# EAGLE design tmc-260-shield (EAGLE 6.3)
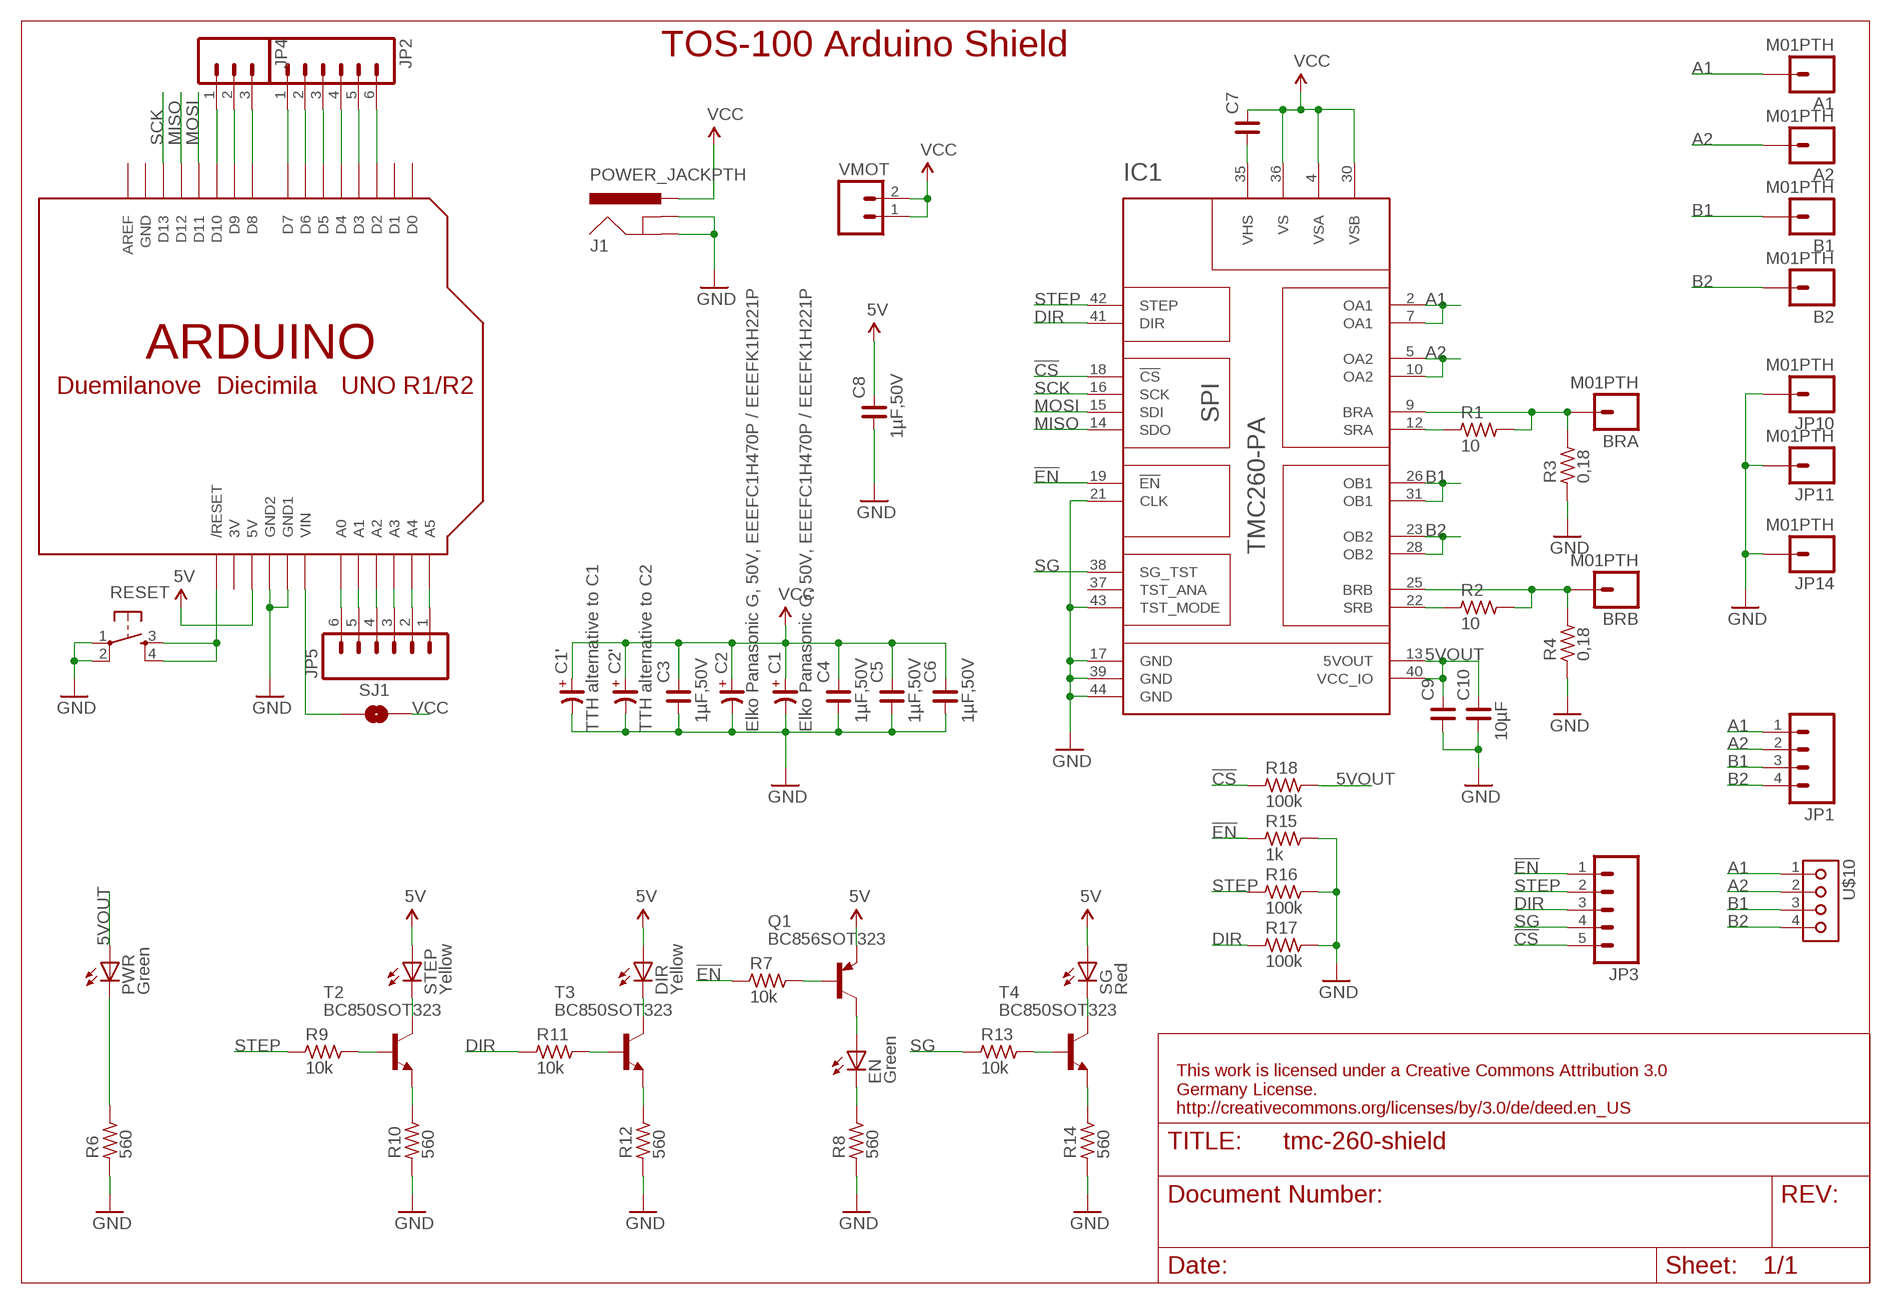
[diagram p0: schematic, sheet 1]

## Parts
A1  M01PTH  [1X01]
A2  M01PTH  [1X01]
B1  M01PTH  [1X01]
B2  M01PTH  [1X01]
BRA  M01PTH  [1X01]
BRB  M01PTH  [1X01]
C1  Elko Panasonic G, 50V, EEEFC1H470P / EEEFK1H221P  CP_SV-G  [CSV-G]
C1'  TTH alternative to C1  CP_E-035X100  [CE-035X100]
C2  Elko Panasonic G, 50V, EEEFC1H470P / EEEFK1H221P  CP_SV-G  [CSV-G]
C2'  TTH alternative to C2  CP_E-035X100  [CE-035X100]
C3  1µF,50V  C_0603  [C0603]
C4  1µF,50V  C_0603  [C0603]
C5  1µF,50V  C_0603  [C0603]
C6  1µF,50V  C_1206  [C1206]
C7  C_0603  [C0603]
C8  1µF,50V  C_0603  [C0603]
C9  C_0603  [C0603]
C10  10µF  C_0603  [C0603]
DIR  Yellow  LEDMICRO-SIDELED  [MICRO-SIDELED]
EN  Green  LEDMICRO-SIDELED  [MICRO-SIDELED]
IC1  TMC260-PA  [PQFP44_WITH_PADS]
J1  POWER_JACKPTH  [POWER_JACK_PTH]
JP1  M04SCREW  [SCREWTERMINAL-3.5MM-4]
JP2  M06SIP  [1X06]
JP3  M05PTH  [1X05]
JP4  M03PTH  [1X03]
JP5  M06SIP  [1X06]
JP10  M01PTH  [1X01]
JP11  M01PTH  [1X01]
JP14  M01PTH  [1X01]
PWR  Green  LEDMICRO-SIDELED  [MICRO-SIDELED]
Q1  BC856SOT323  BC858SOT323  [SOT323-BEC]
R1  10  R_0603  [R0603]
R2  10  R_0603  [R0603]
R3  0,18  R_2512  [R2512]
R4  0,18  R_2512  [R2512]
R6  560  R_0603  [R0603]
R7  10k  R_0603  [R0603]
R8  560  R_0603  [R0603]
R9  10k  R_0603  [R0603]
R10  560  R_0603  [R0603]
R11  10k  R_0603  [R0603]
R12  560  R_0603  [R0603]
R13  10k  R_0603  [R0603]
R14  560  R_0603  [R0603]
R15  1k  R_0603  [R0603]
R16  100k  R_0603  [R0603]
R17  100k  R_0603  [R0603]
R18  100k  R_0603  [R0603]
RESET  TAC_SWITCHSMD  [TACTILE_SWITCH_SMD]
SG  Red  LEDMICRO-SIDELED  [MICRO-SIDELED]
SJ1  SOLDERJUMPERNO  [SJ_2S-NO]
STEP  Yellow  LEDMICRO-SIDELED  [MICRO-SIDELED]
T2  BC850SOT323  [SOT323-BEC]
T3  BC850SOT323  [SOT323-BEC]
T4  BC850SOT323  [SOT323-BEC]
U$1  ARDUINOUNO  [ARDUINO]
U$10  KK4H  [KK-H-4]
VMOT  M021X02_NO_SILK  [1X02_NO_SILK]

## Nets
5V: C8.2 DIR.A Q1.E SG.A STEP.A U$1.5V
5VOUT: C9.2 C10.2 IC1.13(5VOUT) IC1.40(VCC_IO) PWR.A R18.2
!CS: IC1.18(!CS) JP3.5 R18.1
!EN: IC1.19(!EN) JP3.1 R7.1 R15.1
A1: A1.1 IC1.2(OA1) IC1.7(OA1) JP1.1 U$10.1
A2: A2.1 IC1.5(OA2) IC1.10(OA2) JP1.2 U$10.2
B1: B1.1 IC1.26(OB1) IC1.31(OB1) JP1.3 U$10.3
B2: B2.1 IC1.23(OB2) IC1.28(OB2) JP1.4 U$10.4
DIR: IC1.41(DIR) JP3.3 R11.1 R17.1
GND: C1'.- C1.- C2'.- C2.- C3.1 C4.1 C5.1 C6.1 C8.1 C9.1 C10.1 IC1.17(GND) IC1.21(CLK) IC1.39(GND) IC1.43(TST_MODE) IC1.44(GND) J1.GND J1.GNDBREAK JP10.1 JP11.1 JP14.1 R3.1 R4.1 R6.1 R8.1 R10.1 R12.1 R14.1 R15.2 R16.2 R17.2 RESET.1 RESET.2 U$1.GND1 U$1.GND2
MISO: IC1.14(SDO) U$1.D12
MOSI: IC1.15(SDI) U$1.D11
N$1: JP4.1 U$1.D10
N$2: JP4.2 U$1.D9
N$3: JP4.3 U$1.D8
N$4: JP2.1 U$1.D7
N$5: JP2.2 U$1.D6
N$6: JP2.3 U$1.D5
N$7: JP2.4 U$1.D4
N$8: JP2.5 U$1.D3
N$9: JP2.6 U$1.D2
N$10: JP5.1 U$1.A5
N$11: JP5.2 U$1.A4
N$12: JP5.3 U$1.A3
N$13: JP5.4 U$1.A2
N$14: JP5.5 U$1.A1
N$15: JP5.6 U$1.A0
N$16: R9.2 T2.B
N$17: RESET.3 RESET.4 U$1.RESET(/RESET)
N$18: SJ1.1 U$1.VIN
N$19: STEP.C T2.C
N$20: R10.2 T2.E
N$21: PWR.C R6.2
N$24: R11.2 T3.B
N$25: DIR.C T3.C
N$26: R12.2 T3.E
N$27: EN.A Q1.C
N$28: BRA.1 IC1.9(BRA) R1.2 R3.2
N$29: IC1.12(SRA) R1.1
N$30: BRB.1 IC1.25(BRB) R2.2 R4.2
N$31: IC1.22(SRB) R2.1
N$35: EN.C R8.2
N$36: Q1.B R7.2
N$38: R13.2 T4.B
N$39: SG.C T4.C
N$40: R14.2 T4.E
SCK: IC1.16(SCK) U$1.D13
SG: IC1.38(SG_TST) JP3.4 R13.1
STEP: IC1.42(STEP) JP3.2 R9.1 R16.1
VCC: C1'.+ C1.+ C2'.+ C2.+ C3.2 C4.2 C5.2 C6.2 C7.2 IC1.4(VSA) IC1.30(VSB) IC1.36(VS) J1.PWR SJ1.2 VMOT.1 VMOT.2
VHS: C7.1 IC1.35(VHS)
Unconnected: IC1.37(TST_ANA) U$1.AREF U$1.D0 U$1.D1

## Notes on the sheet
- TOS-100 Arduino Shield
- This work is licensed under a Creative Commons Attribution 3.0 
  Germany License.
  http://creativecommons.org/licenses/by/3.0/de/deed.en_US

## Power pins joined to a net without a drawn wire
3V: U$1.3V
GND: U$1.GND

## Library data of the parts
A1 A2 B1 B2 BRA BRB JP10 JP11 JP14 = SparkFun:M01: Header 1 Standard 1-pin 0.1" header. Use with straight break away headers (SKU : PRT-00116), right angle break away headers (PRT-00553), swiss pins (PRT-00743), machine pins (PRT-00117), and female headers (PRT-00115).
C1 C1' C2 C2' = rc-master:CP_: POLARIZED CAP
C3-C10 = rc-master-smd:C_: NON-POLARIZED CAP
DIR EN PWR SG STEP = LED:LED: LED OSRAM: - CHIPLED LG R971, LG N971, LY N971, LG Q971, LY Q971, LO R971, LY R971 LH N974, LH R974 LS Q976, LO Q976, LY Q976 LO Q996 - Hyper CHIPLED LW Q18S LB Q993, LB Q99A, LB R99A - SideLED LS A670, LO A670, LY A670, LG A670, LP A670 LB A673, LV A673, LT A673, LW A673 LH A674 LY A675 LS A676, LA A676, LO A676, LY A676, LW A676 LS A679, LY A679, LG A679 - Hyper Micro SIDELED® LS Y876, LA Y876, LO Y876, LY Y876 LT Y87S - SmartLED LW L88C, LW L88S LB L89C, LB L89S, LG L890 LS L89K, LO L89K, LY L89K LS L896, LA L896, LO L896, LY L896 - TOPLED LS T670, LO T670, LY T670, LG T670, LP T670 LSG T670, LSP T670, LSY T670, LOP T670, LYG T670 LG T671, LOG T671, LSG T671 LB T673, LV T673, LT T673, LW T673 LH T674 LS T676, LA T676, LO T676, LY T676, LB T676, LH T676, LSB T676, LW T676 LB T67C, LV T67C, LT T67C, LS T67K, LO T67K, LY T67K, LW E67C LS E67B, LA E67B, LO E67B, LY E67B, LB E67C, LV E67C, LT E67C LW T67C LS T679, LY T679, LG T679 LS T770, LO T770, LY T770, LG T770, LP T770 LB T773, LV T773, LT T773, LW T773 LH T774 LS E675, LA E675, LY E675, LS T675 LS T776, LA T776, LO T776, LY T776, LB T776 LHGB T686 LT T68C, LB T68C - Hyper Mini TOPLED® LB M676 - Mini TOPLED Santana® LG M470 LS M47K, LO M47K, LY M47K Source: http://www.osram.convergy.de LUXEON: - LUMILED® LXK2-PW12-R00, LXK2-PW12-S00, LXK2-PW14-U00, LXK2-PW14-V00 LXK2-PM12-R00, LXK2-PM12-S00, LXK2-PM14-U00 LXK2-PE12-Q00, LXK2-PE12-R00, LXK2-PE12-S00, LXK2-PE14-T00, LXK2-PE14-U00 LXK2-PB12-K00, LXK2-PB12-L00, LXK2-PB12-M00, LXK2-PB14-N00, LXK2-PB14-P00, LXK2-PB14-Q00 LXK2-PR12-L00, LXK2-PR12-M00, LXK2-PR14-Q00, LXK2-PR14-R00 LXK2-PD12-Q00, LXK2-PD12-R00, LXK2-PD12-S00 LXK2-PH12-R00, LXK2-PH12-S00 LXK2-PL12-P00, LXK2-PL12-Q00, LXK2-PL12-R00 Source: www.luxeon.com KINGBRIGHT: KA-3528ASYC Source: www.kingbright.com
IC1 = trinamic-2:TMC260-PA: TRINAMIC Energy Efficient Microstep Driver for up to 1.7A with coolStep™ Information given in this library is believed to be accurate and reliable. However no warranty is given for its correctness. Datasheet for TMC260/261/262 <http://www.trinamic.com/tmc/media/Downloads/integrated_circuits/TMC262/TMC260_TMC261_TMC262_datasheet.pdf> Description Energy Efficient Microstep Driver for up to 1.7A with coolStep™ The TMC260 is the first energy efficient high precision microstepping driver IC for bipolar stepper motors with integrated power MOSFETs. The unique high resolution sensorless load detection stallGuard2™ is used to for the world™s first integrated load dependent current control feature called coolStep™. The ability to read out the load and detect an overload makes the TMC260 an optimum choice for drives where a high reliability is desired at a low cost. The new patented spreadCycle PWM mixed decay chopper scheme ensures best zero crossing performance as well as high speed operation. The TMC260 can be driven with Step & Direction signals as well as by serial SPI™ interface. Using the microPlyer allows to operate the motor with highest 256 ™Step smoothness reducing the input frequency to 16 ™Steps. A full set of protection and diagnostic features makes this device very rugged. It directly drives stepper motors with up to 1.7A. This way it reaches highest energy efficiency and allows driving of a high motor current without cooling measures even at high environment temperatures. Specifications Main characteristics 2-phase bipolar stepper motor driver stallGuard2™ sensorless load detection coolStep™ load dependent current control save up to 80% energy spreadCycle hysteresis PWM chopper best current zero crossing performance best sine wave form 256 ™Steps/fullstep (51200 pos/rev.) with a standard 200 step motor microPlyer 16-to-256 ™Step multiplyer full protection and diagnostics lowest power dissipation programmable slope control for low EME standby and shutdown mode stall / load detection output Low power consumption via low RDS-ON power stage Interface Step & Direction easy-to-use SPI™ (20bit) Electrical Data up to 1.7A coil current (peak) 9V to 40V motor supply 3.3V or 5V operation for digital part Package TQFP44 10x10 mm² package RoHS compliant
J1 = SparkFun:POWER_JACK: Power Jack This is the standard 5.5mm barrel jack for power. The PTH is the most common, proven, reliable, footprint. All others are experimental. The Slot footprint only works if the mill layer is transmitted to the PCB fab house so be warned. Spark Fun Electronics SKU : PRT-00119. Mating wall wart : TOL-00298 (and others)
JP1 = SparkFun:M04: Header 4 Standard 4-pin 0.1" header. Use with straight break away headers (SKU : PRT-00116), right angle break away headers (PRT-00553), swiss pins (PRT-00743), machine pins (PRT-00117), and female headers (PRT-00115). Molex polarized connector foot print use with SKU : PRT-08231 with associated crimp pins and housings.
JP2 JP5 = SparkFun:M06: Header 6 Standard 6-pin 0.1" header. Use with straight break away headers (SKU : PRT-00116), right angle break away headers (PRT-00553), swiss pins (PRT-00743), machine pins (PRT-00117), and female headers (PRT-00115). Molex polarized connector foot print use with SKU : PRT-08094 with associated crimp pins and housings. NOTES ON THE VARIANTS LOCK and LOCK_LONGPADS... This footprint was designed to help hold the alignment of a through-hole component (i.e. 6-pin header) while soldering it into place. You may notice that each hole has been shifted either up or down by 0.005 of an inch from it's more standard position (which is a perfectly straight line). This slight alteration caused the pins (the squares in the middle) to touch the edges of the holes. Because they are alternating, it causes a "brace" to hold the component in place. 0.005 has proven to be the perfect amount of "off-center" position when using our standard breakaway headers. Although looks a little odd when you look at the bare footprint, once you have a header in there, the alteration is very hard to notice. Also, if you push a header all the way into place, it is covered up entirely on the bottom side. This idea of altering the position of holes to aid alignment will be further integrated into the Sparkfun Library for other footprints. It can help hold any component with 3 or more connection pins.
JP3 = SparkFun:M05: Header 5 Standard 5-pin 0.1" header. Use with straight break away headers (SKU : PRT-00116), right angle break away headers (PRT-00553), swiss pins (PRT-00743), machine pins (PRT-00117), and female headers (PRT-00115). Molex polarized connector foot print use with SKU : PRT-08230 with associated crimp pins and housings.
JP4 = SparkFun:M03: Header 3 Standard 3-pin 0.1" header. Use with straight break away headers (SKU : PRT-00116), right angle break away headers (PRT-00553), swiss pins (PRT-00743), machine pins (PRT-00117), and female headers (PRT-00115). Molex polarized connector foot print use with SKU : PRT-08232 with associated crimp pins and housings.
Q1 = additional:BC858*: PNP Transistror
R1-R4 R6-R18 = rc-master-smd:R_: RESISTOR
RESET = SparkFun:TAC_SWITCH: Momentary Switch Button commonly used for reset or general input. Spark Fun Electronics SKU : COM-00097
SJ1 = SparkFun:SOLDERJUMPER: Solder Jumper Standard SMD solder jumper. Used to automate production. Two varients : Normally Open and Normally Closed are the same, but have different paste layers. NC will have a large amount of paste and should jumper during reflow.
T2-T4 = additional:BC850: NPN TRANSISTOR
U$1 = adafruit:ARDUINO: Arduino Diecimila/Duemilanove Make a shield with ease, this package has all the named pins as well as the two mounting drill holes and an outline of the USB and DC power connector. The outline is on the DIMENSION layer, so if your board house uses it they will cut the outline to match. http://www.ladyada.net/library/pcb/eaglelibrary.html
U$10 = molex-kk:KK4*
VMOT = SparkFun:M02: Header 2 Standard 2-pin 0.1" header. Use with straight break away headers (SKU : PRT-00116), right angle break away headers (PRT-00553), swiss pins (PRT-00743), machine pins (PRT-00117), and female headers (PRT-00115). Molex polarized connector foot print use with SKU : PRT-08233 with associated crimp pins and housings.

## Board
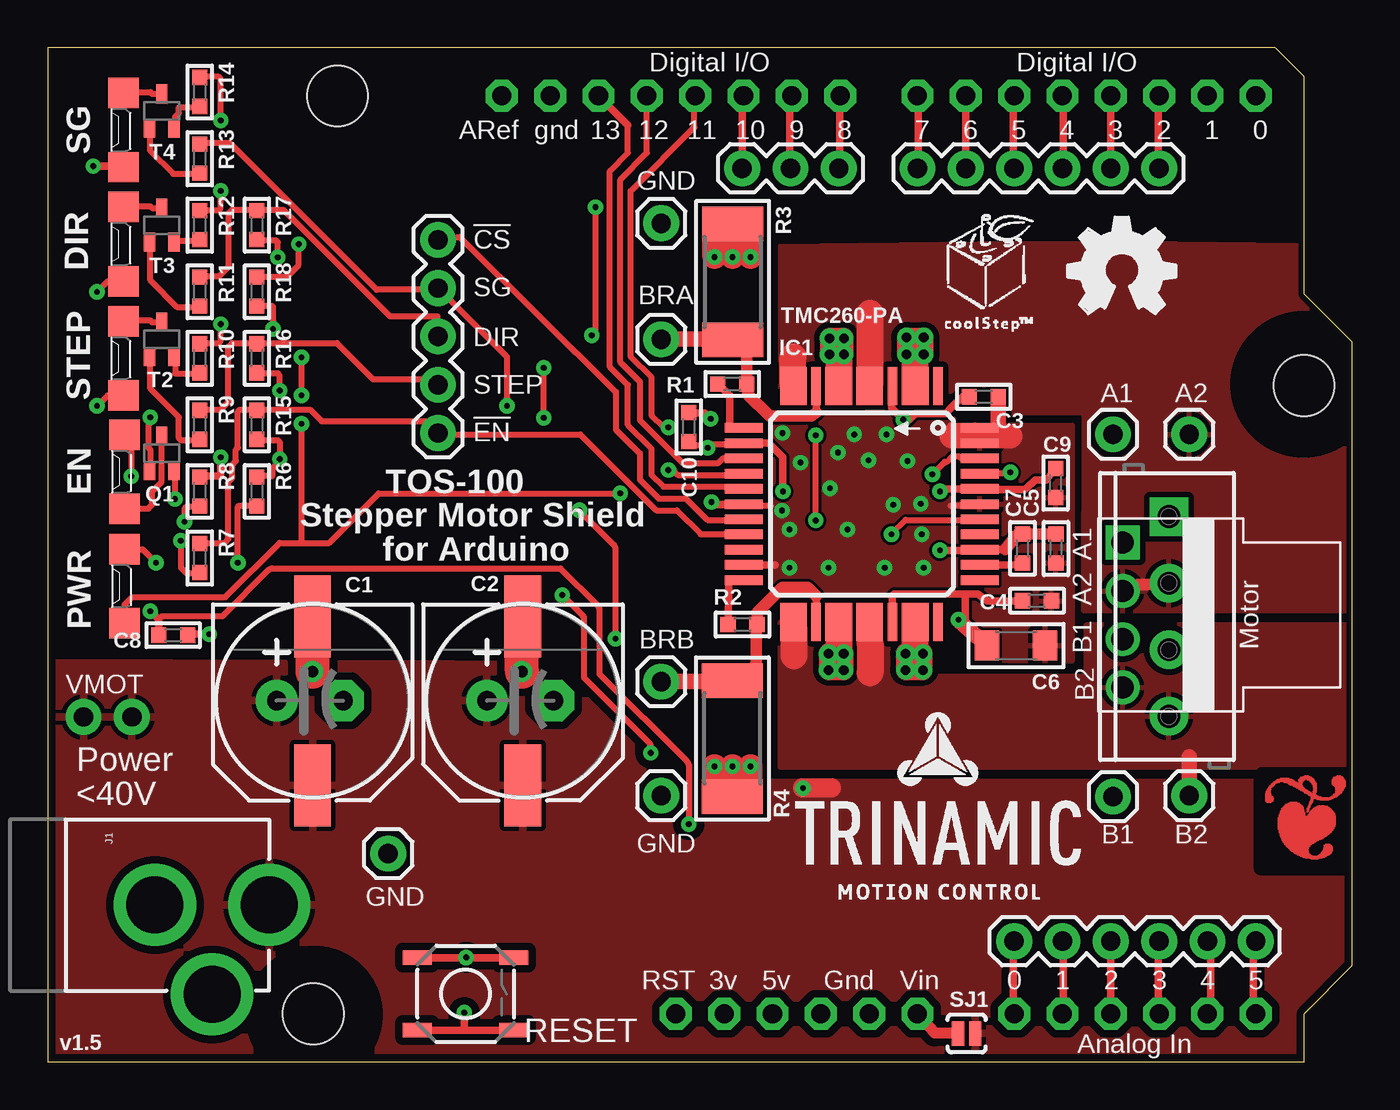
[diagram p1: board, top side]
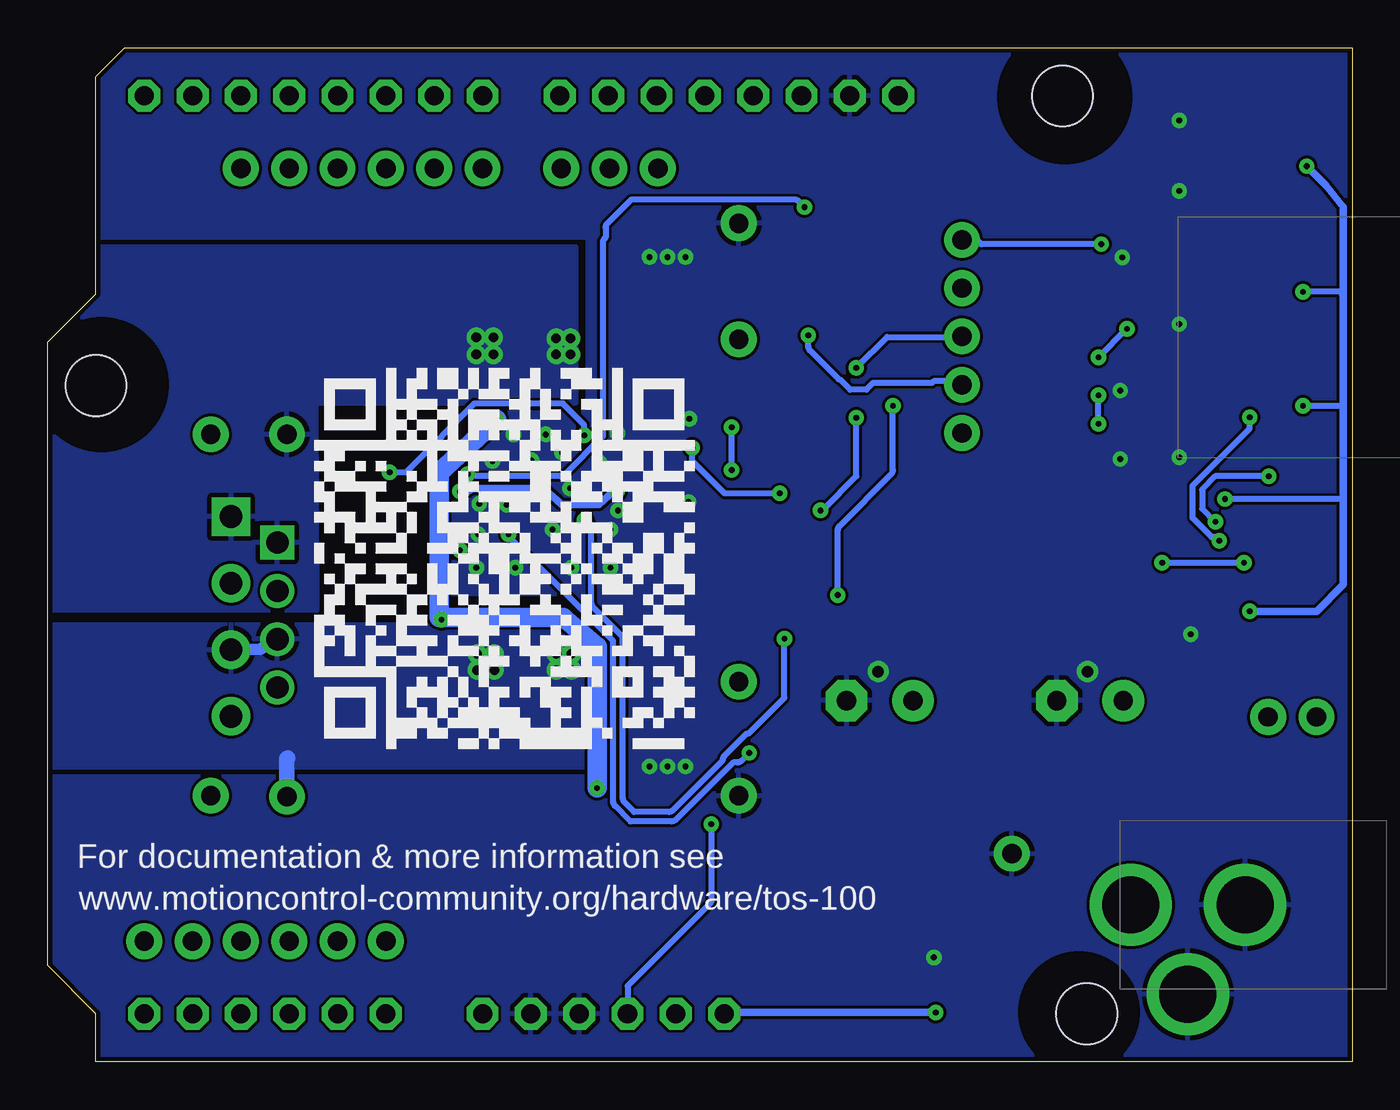
[diagram p2: board, bottom side, seen from below]

Size 68.58 x 53.34 mm. Coordinates in mm from the lower left corner, seen from the top.
Copper layers (1*16): Top 0.035mm / dielectric 1.5mm / Bottom 0.035mm
Design rules "eurocircuits-PCB-Proto": minimum track width 0.15mm, minimum drill 0.25mm, track to track 0.15mm, track to pad 0.15mm, pad to pad 0.15mm, via to via 0.15mm, smd to smd 0.15mm, copper to edge 10mil, drill to drill 8mil, minimum pad ring 12mil, minimum via ring 10mil, stop-mask expansion 4mil, vias tented up to drill 25mil, thermal gap 10mil
tRestrict: area 62.9,32.5 to 69.1,38.8; area 10.8,-0.7 to 17.2,5.7; 4 lines
bRestrict: area 62.6,32.5 to 68.9,38.8; area 12,47.6 to 18.3,53.9; area 11.2,-0.6 to 17.6,5.8

### Footprints (pad centres in the part's own frame; a part is rotated, then mirrored left to right if it is on the bottom)
1X01 = drill 1.016 pad 1.88: 1 0,0
CSV-G = smd 4.318 x 1.93: + -4.445,0; - 4.445,0
CE-035X100 = drill 1.016 pad 2.184: + -1.905,0 | drill 1.016 pad 2.184 octagon: - 1.587,0
C0603 = smd 0.8 x 0.8: 1 -0.762,0; 2 0.762,0
C1206 = smd 1.3 x 1.6: 1 -1.524,0; 2 1.524,0
MICRO-SIDELED = smd 1.6 x 1.6: A 0,1.95; C 0,-1.95
PQFP44_WITH_PADS = smd 2 x 0.5: 1 -6.327,4.254; 4 -6.327,1.854; 9 -6.327,-2.146; 25 6.073,-2.146; 30 6.073,1.854; 33 6.073,4.254 | smd 2 x 1.4: 2 -6.327,3.06; 5 -6.327,0.66; 7 -6.327,-0.965; 10 -6.327,-3.34; 23 6.073,-3.34; 26 6.073,-0.965; 28 6.073,0.66; 31 6.073,3.06 | smd 0.5 x 2: 12 -4.127,-5.946; 13 -3.327,-5.946; 14 -2.527,-5.946; 15 -1.727,-5.946; 16 -0.927,-5.946; 17 -0.127,-5.946; 18 0.673,-5.946; 19 1.473,-5.946; 20 2.273,-5.946; 21 3.073,-5.946; 22 3.873,-5.946; 34 3.873,6.454; 35 3.073,6.454; 36 2.273,6.454; 37 1.473,6.454; 38 0.673,6.454; 39 -0.127,6.454; 40 -0.927,6.454; 41 -1.727,6.454; 42 -2.527,6.454; 43 -3.327,6.454; 44 -4.127,6.454
POWER_JACK_PTH = drill 2.997 pad 4.318: GND 0,7.7; GNDBREAK 4.7,10.7; PWR 0,13.7
SCREWTERMINAL-3.5MM-4 = drill 1.2 pad 2.032 square: 1 0,0 | drill 1.2 pad 2.032: 2 3.5,0; 3 7,0; 4 10.5,0
1X06 = drill 1.016 pad 1.88: 1 0,0; 2 2.54,0; 3 5.08,0; 4 7.62,0; 5 10.16,0; 6 12.7,0
1X05 = drill 1.016 pad 1.88: 1 0,0; 2 2.54,0; 3 5.08,0; 4 7.62,0; 5 10.16,0
1X03 = drill 1.016 pad 1.88: 1 0,0; 2 2.54,0; 3 5.08,0
SOT323-BEC = smd 0.6 x 1: B -0.65,-0.9; C 0,0.9; E 0.65,-0.9
R0603 = smd 0.8 x 0.8: 1 -0.762,0; 2 0.762,0
R2512 = smd 1.8 x 3.2: 1 -3.048,0; 2 3.048,0
TACTILE_SWITCH_SMD = smd 1.524 x 0.762: 1 -2.54,1.905; 2 2.54,1.905; 3 -2.54,-1.905; 4 2.54,-1.905
SJ_2S-NO = smd 0.635 x 1.27: 1 -0.45,0; 2 0.45,0
ARDUINO = drill 1 pad 1.676 octagon: 3V 35.56,2.54; 5V 38.1,2.54; A0 50.8,2.54; A1 53.34,2.54; A2 55.88,2.54; A3 58.42,2.54; A4 60.96,2.54; A5 63.5,2.54; AREF 23.876,50.8; D0 63.5,50.8; D1 60.96,50.8; D2 58.42,50.8; D3 55.88,50.8; D4 53.34,50.8; D5 50.8,50.8; D6 48.26,50.8; D7 45.72,50.8; D8 41.656,50.8; D9 39.116,50.8; D10 36.576,50.8; D11 34.036,50.8; D12 31.496,50.8; D13 28.956,50.8; GND 26.416,50.8; GND1 43.18,2.54; GND2 40.64,2.54; RESET 33.02,2.54; VIN 45.72,2.54 | hole 3.2: 15.24,50.8; 66.04,35.56; 13.97,2.54
KK-H-4 = drill 1.168 square: 1 0,3.81 | drill 1.168: 2 0,1.27; 3 0,-1.27; 4 0,-3.81
1X02_NO_SILK = drill 1.016 pad 1.88: 1 0,0; 2 2.54,0

### Placement (x,y rotation side)
A1  56,33 0 top
A2  60,33 0 top
B1  56,13.95 0 top
B2  60,14 0 top
BRA  32.25,38 0 top
BRB  32.25,20 0 top
C1  13.93,18.98 90 top
C1'  25,19 0 top
C2  24.98,18.98 90 top
C2'  13.95,19 0 top
C3  49.2,34.98 180 top
C4  52,24.25 180 top
C5  53,27 90 top
C6  50.9,21.9 180 top
C7  51.24,27 90 top
C8  6.6,22.45 180 top
C9  52.98,30.44 90 top
C10  33.7,33.38 270 top
DIR  4,43 180 top
EN  4.04,31.03 180 top
IC1  42.55,29.21 270 top
J1  -2.06,8.26 270 top
JP1  58.94,28.68 270 top
JP2  45.72,46.99 0 top
JP3  20.52,33.07 90 top
JP4  36.51,46.99 0 top
JP5  63.5,6.35 180 top
JP10  32.25,14 0 top
JP11  32.25,44.1 0 top
JP14  17.9,10.95 0 top
PWR  4.04,25.02 180 top
Q1  6,32 0 top
R1  35.98,35.65 0 top
R2  36.52,23 0 top
R3  36.01,41.02 270 top
R4  35.99,17 90 top
R6  11,30 270 top
R7  8,26.5 270 top
R8  8,30 270 top
R9  8,33.5 270 top
R10  8,37 270 top
R11  8,40.5 270 top
R12  8,44 270 top
R13  8,47.5 270 top
R14  8,51 270 top
R15  11,33.5 270 top
R16  11,37 270 top
R17  11,44 270 top
R18  11,40.5 270 top
RESET  21.97,3.58 0 top
SG  4,49 180 top
SJ1  48.3,1.5 0 top
STEP  4,37 180 top
T2  6,38 0 top
T3  6,44 0 top
T4  6,50 0 top
U$1  0,0 0 top
U$5  [LOGO]  39.3,8.55 0 top
U$9  [COOLSTEP]  46.85,38.25 0 top
U$10  56.5,23.5 0 top
U$11  [OSHW_FILLX200_NOTEXT]  53.62,39.35 0 top
U$12  [SMALL_LOGO_COPPER]  63.5,10.3 0 top
U$13  [QR-TMC-100-BOTTOM-BIG]  34.6,16.5 0 top
VMOT  1.89,18.14 0 top

### Tracks (layer width: path | path; a pad name or v marks a point on that pad's centre or on a via)
5V  (via drill 0.3)
  Top 0.305: 4,41.1 DIR.A 3.15,41.05 v2.6,40.5 | 4,35.1 STEP.A 3.15,35.05 v2.6,34.5 | v6.7,29.6 6.7,31.1 Q1.E | 5.84,23.26 6.03,23.45 9.2,23.45 11.61,25.86 arc-45 11.83,25.95 26.95,25.95 28.91,23.99 arc-45 29,23.77 29,20.4 33.61,15.79 arc-45 33.7,15.57 v33.7,12.5
  Top 0.406: v2.4,47.1 4,47.1 SG.A | C8.2 5.84,23.26 v5.4,23.7
  Bottom 0.305: 0.47,29.6 v6.7,29.6 | v2.6,40.5 0.67,40.5 0.47,40.3 | v2.6,34.5 0.57,34.5 0.47,34.4 | v33.7,12.5 33.7,8.4 38.1,4 U$1.5V
  Bottom 0.406: v2.4,47.1 1.4,46.1 0.47,44.96 0.47,40.3 0.47,34.4 0.47,29.6 0.47,25.1 1.87,23.7 v5.4,23.7
5VOUT  (via drill 0.3)
  Top 0.305: C10.2 33.7,32.4 34.7,32.4 v34.7,32.3 34.8,32.5 36.4,32.5 IC1.13 | 13.35,27.3 14.8,27.3 17.4,29.9 v30.1,29.9 | v11.85,38.55 11.85,39.7 11.8,39.75 R18.2 | v13.35,35.05 v13.35,37.05 | 13.35,27.3 v13.35,33.55 | 13.35,27.3 12.2,27.3 9.35,24.45 4.45,24.45 4.05,24.05 PWR.A
  Top 0.406: IC1.40 49,30.12 | 36.75,32.5 IC1.13 36.61,32.55 37.9,32.55 38.65,31.8 v38.65,30 | IC1.40 48.88,30.12 47.02,30.12 v46.9,30 | IC1.40 49.2,30.1 51.35,30.1 51.5,30.2 51.9,30.6 52.5,30.6 C9.2
  Bottom 0.305: v30.1,29.9 33,29.9 34.7,31.6 v34.7,32.3 | v13.35,37.05 v11.85,38.55 | v13.35,33.55 v13.35,35.05
  Bottom 0.406: v46.9,30 46.5,30 46.25,30.15 42.5,30.15 41.55,29.3 39.6,29.3 38.85,30 v38.65,30
!CS  (via drill 0.3)
  Top 0.305: IC1.18 36.5,28.5 34.67,28.5 33.55,29.62 32.12,29.62 31.12,30.62 31.12,32 29.88,33.25 29.88,35.23 21.68,43.38 20.75,43.38 20.62,43.25 JP3.5 | R18.1 11,41.3 12.6,41.3 13.2,41.9 v13.2,43
  Bottom 0.305: v13.2,43 19.5,43 19.7,43.2 20.5,43.2 JP3.5
!EN
  Top 0.305: IC1.19 36.5,27.75 34.33,27.75 33.08,29 32,29 28,33 20.62,33 JP3.1 20.5,33.2 20.5,33.7 14.4,33.7 13.8,34.3 11.1,34.3 R15.1 10.9,34.3 10.1,34.3 10,34.2 10,32.3 9.9,32.2 9.9,31.6 9.7,31.4 9.7,30.7 9.5,30.5 9.5,27.5 9.3,27.3 8,27.3 R7.1
A1  (via drill 0.5)
  Top 0.813: IC1.2 45.6,35.75 | IC1.7 41.6,35.75
  Top 1.016: 41.6,37.55 v41.1,38.05 v41.1,37.2 v41.85,37.2 41.85,38.1 41.1,38.1 | 45.6,37.75 v45.15,38.1 | v45.15,38.1 v46.05,38.1 v46.05,37.2 | v45.15,38.1 v45.15,37.2
  Top 1.422: 41.6,35.75 41.6,37.55 | 45.6,35.75 45.6,37.75
  other vias: 41.85,38.05
  pour Bottom: 70.5,42.88 40.83,42.88 40.83,34.62 54.48,34.62 54.42,23.75 70.5,23.75
A2
  Top 0.61: 56.3,24.7 57.3,25.1 58.8,25.1
  Top 0.813: IC1.5 43.23,35.67 | IC1.10 39.17,35.65
  Top 1.422: 43.23,35.67 43.23,39.38 | 39.17,35.65 39.17,37.08
  pour Top (isolate 0.305): 38.5,34.85 48.15,35.05 48.15,34.15 54.45,34.15 54.42,23.75 69.12,23.75 69.75,42.88 arc2 38.5,42.88
B1  (via drill 0.5)
  Top 0.305: v41.84,21.46 41.83,21.35
  Top 0.813: 41.7,22.6 41.62,22.62 41.58,22.86 IC1.26
  Top 1.016: 41.7,22.6 41.7,22.5 41.6,22.8 | 41.85,21.5 41.6,21.1 | 41.85,21.5 v41.85,20.6 v41.05,20.6 41.05,21.5 | 41.83,21.35 41.85,21.5 | 45.6,21 45.49,21 v45.1,20.61 | v45.1,20.6 v46,20.6 46,21.5 45.1,21.5 v45.1,21.46 v45.1,20.6
  Top 1.422: 41.6,21.1 41.6,22.8 | 45.6,21 IC1.31
  Bottom 0.61: 56.6,22.3 57.4,21.7 58.8,21.7
  Bottom 0.813: B1.1 56,15.95 55.95,16
  other vias: 41.05,21.46 46,21.46
  pour Bottom: 40.45,15.5 69.25,15.5 69.25,23 41.75,23 40.4,21.93 40.4,21.1
B2
  Top 0.813: 43.23,22.01 IC1.28 | 39.23,22.75 IC1.23 | U$10.4 56.5,19.62 | B2.1 60,16.05
  Top 1.422: 43.23,22.01 43.23,20.47 | 39.23,22.75 39.23,21.38
  pour Top (isolate 0.305): 38.5,23.12 46.4,22.9 46.4,20.3 54.6,20.3 54.6,23 69,23 69.12,15.5 38.5,15.5 arc1
DIR  (via drill 0.3)
  Top 0.305: v26.07,33.88 v26.07,36.5 | v40.38,28.48 v40.38,32.95 | 49,30.88 IC1.41 50.39,30.94 v50.6,31 | R11.1 8,41.3 9,41.3 9.5,41.8 9.5,44.6 9.7,44.8 11,44.8 R17.1 11.1,44.8 12.4,44.8 18,39.2 20.5,39.2 20.5,38.2 JP3.3 | v29.85,22.25 29.85,26.97 arc45 29.76,27.19 v27.95,29
  Bottom 0.305: v26.07,33.88 26.07,30.8 27.82,29.05 arc45 v27.95,29 | v26.07,36.5 24.45,38.12 20.62,38.12 JP3.3 | v40.38,28.48 40,28.25 40,24.13 arc-45 39.91,23.91 38.35,22.35 38.35,13.88 arc-45 38.26,13.66 37.75,13.15 35.93,13.15 arc-45 35.71,13.24 33.1,15.85 33.1,15.87 arc45 33.01,16.09 31.85,17.25 arc-45 31.68,17.32 29.85,19.15 v29.85,22.25 | v40.38,32.95 40.38,33.5 41.5,34.62 46.15,34.62 47.8,32.98 47.9,32.85 49.75,31 v50.6,31
GND  (via drill 0.3, 0.6)
  Top 0.254: 36,43.87 36.01,43.87 R3.1 | v35.05,15.54 35,15.5 35.05,15.5
  Top 0.305: 47.45,29.25 48.75,29.25 IC1.39 | 47.45,32.5 48.75,32.5 IC1.43 | 47.45,33.48 48.75,33.48 IC1.44 | 38.02,29.25 36.73,29.25 IC1.17 | v9.1,49.5 9.1,51.7 9,51.8 8,51.8 R14.1 | v9.1,45.8 9.1,44.9 9,44.8 8,44.8 R12.1 | v12.1,42.3 12.1,43.1 12,43.2 11,43.2 R17.2 | v9.1,38.8 9.1,37.9 9,37.8 8,37.8 R10.1 | v12.2,35.3 12.2,36.1 12.1,36.2 11,36.2 R16.2 | R15.2 11,32.7 12.1,32.7 12.2,32.6 v12.2,31.7 12.1,31.6 12.1,31.5 11.8,31.2 11.8,30.8 11,30.8 R6.1
  Top 0.406: C10.1 33.75,34.12 34.55,34.12 v34.85,33.83 | IC1.21 38.25,26.14 38.25,26.12 | v9.1,31.8 9.1,30.9 9,30.8 8,30.8 R8.1 | RESET.1 21.98,5.49 v22,5.5 22.02,5.49 RESET.2 | C8.1 7.47,22.5 v8.5,22.5 | 36.5,29.3 35.23,29.3 arc-45 35.01,29.39 34.9,29.5 arc45 34.9,29.49 v34.9,29.45
  Top 0.813: C3.1 49.96,33.19 50.25,32.9
  Top 1.27: R4.1 v35.99,15.54 | v36,42.33 36,43.87 | v35.05,42.33 35.05,43.87 | v36.95,42.33 36.95,43.87 | 35.05,13.96 35.05,15.5 v35.05,15.54 | 36.95,13.96 v36.95,15.54 | 47.5,32.9 50.25,32.9 50.6,32.9
  Top 1.778: v13.93,20.53 C1.- | v24.93,20.53 C2.-
  other vias: 38.62,33.07 39.57,31.52 38.59,29 45.9,29.34 38.99,26 41.05,26 43.99,26 45.95,27.75 46.05,26 44.45,29.3 45.2,31.59 44.09,32.99 43.15,31.64 42.4,32.99 41.55,32.05 41.12,30.17 38.99,28 42.05,28
  pour Bottom: 70.48,-1.91 -1.27,-1.91 -1.27,54.61 66.75,54.73 66.62,43.38 40.2,43.38 40.2,34.12 47.38,34.12 47.38,24.62 41.5,24.6 41.5,23.82 39.52,22.23 39.52,15 70.25,15 70.25,10
  pour Top: 38.02,25.02 38.02,33.8 38.35,34.12 47.52,34.23 47.65,33.5 53.85,33.5 53.85,21.05 47.1,21.1 47.1,23.9 46.75,24.23 46.83,24.8 38.35,24.7
MISO
  Top 0.305: 36.5,31.75 35.5,31.75 35.25,31.5 33.38,31.5 31.12,33.75 31.12,35.77 30.1,36.8 30.1,46.4 31.5,47.8 U$1.D12
  Top 0.406: 36.5,31.75 IC1.14 | 31.12,50.5 31.38,50.75 U$1.D12
MOSI  (via drill 0.3)
  Top 0.305: 32.38,33.38 31.75,34 31.75,36 30.65,37.1 30.65,45.8 34,49.15 34,50.76 U$1.D11 | 32.88,31.12 33.12,30.88 36.5,30.88 IC1.15
  Top 0.406: v32.62,33.38 32.38,33.38 | v32.62,31.12 32.88,31.12 | U$1.D11 34,50.75
  Bottom 0.305: v32.62,31.12 v32.62,33.38
N$1
  Top 0.406: JP4.1 36.5,50.75 U$1.D10
N$2
  Top 0.406: JP4.2 39,47 39,50.75 U$1.D9
N$3
  Top 0.406: JP4.3 41.62,47 41.62,50.75 U$1.D8
N$4
  Top 0.406: JP2.1 45.75,47 45.75,50.75 U$1.D7
N$5
  Top 0.406: JP2.2 48.25,50.75 U$1.D6
N$6
  Top 0.406: JP2.3 50.75,47 50.75,50.75 U$1.D5
N$7
  Top 0.406: JP2.4 53.38,47 53.38,50.75 U$1.D4
N$8
  Top 0.406: JP2.5 55.88,50.75 U$1.D3
N$9
  Top 0.406: JP2.6 58.38,47 58.38,50.75 U$1.D2
N$10
  Top 0.406: U$1.A5 63.5,2.62 63.38,2.75 63.38,6.12 63.5,6.25 JP5.1
N$11
  Top 0.406: U$1.A4 61,2.62 61.12,2.75 61.12,6.12 61,6.25 JP5.2
N$12
  Top 0.406: U$1.A3 58.38,2.62 58.38,6.25 JP5.3
N$13
  Top 0.406: U$1.A2 55.88,2.62 55.88,6.25 JP5.4
N$14
  Top 0.406: JP5.5 53.38,6.25 53.38,2.62 U$1.A1
N$15
  Top 0.406: JP5.6 50.75,6.25 50.75,2.62 U$1.A0
N$16
  Top 0.305: R9.2 8,32.7 7,32.7 6.9,32.8 6.9,33.9 5.4,35.4 5.4,37.1 T2.B
N$17  (via drill 0.3)
  Top 0.406: RESET.3 21.9,1.68 | 21.9,1.68 RESET.4 | 21.9,1.68 v21.9,2.6
  Bottom 0.406: v21.9,2.6 32.96,2.6 U$1.RESET
N$18
  Top 0.61: U$1.VIN 46.62,1.53 SJ1.1
N$19
  Top 0.305: T2.C 5.5,38.9 5.4,39 4,39 STEP.C
N$20
  Top 0.305: R10.2 8,36.2 6.7,36.2 6.7,37.1 T2.E
N$21  (via drill 0.3)
  Top 0.305: v5.7,26.25 5,26.95 4.05,26.95 PWR.C | v10,26.25 10,29.2 10.05,29.25 R6.2
  Bottom 0.305: v5.7,26.25 v10,26.25
N$24
  Top 0.305: R11.2 8,39.7 6.8,39.7 5.4,41.1 5.4,43.1 T3.B
N$25
  Top 0.305: T3.C 5.5,44.9 5.4,45 4,45 DIR.C
N$26
  Top 0.305: R12.2 8,43.2 6.7,43.2 6.7,43.1 T3.E
N$27
  Top 0.305: Q1.C 6,30.5 5.5,30 5.5,29.3 5.3,29.1 4.1,29.1 EN.A
N$28
  Top 0.406: IC1.9 40.4,34.15 40.4,34.1
  Top 0.61: 40.4,34.15 40.15,33.95 37.95,33.95 36.8,35.1 36.8,35.65 R1.2 36.75,35.95 36.75,37.9 36.7,37.95 36.05,37.95 R3.2
  Top 0.813: BRA.1 35.98,38 R3.2
N$29
  Top 0.406: 36.5,33.38 IC1.12 36.54,33.4 35.9,33.4 35.85,33.6 35.85,35.05 35.25,35.65 R1.1
N$30
  Top 0.406: 40.4,24.5 IC1.25
  Top 0.61: 40.4,24.5 39.95,24.95 38.6,24.95 37.29,23.64 R2.2 37.25,23.02 37.25,20.9 36.4,20.05 R4.2
  Top 0.813: BRB.1 35.94,20 R4.2
N$31
  Top 0.406: R2.1 35.81,24.91 35.8,25.4 36.54,25.4 IC1.22
N$35  (via drill 0.3)
  Top 0.305: R8.2 8,29.2 7.3,29.2 7.2,29.1 v7.2,28.4 7.2,28.3 | v4.4,30.8 4.4,33 4.1,33 EN.C
  Bottom 0.305: v7.2,28.4 7.9,29.1 7.9,30.1 7.2,30.8 v4.4,30.8
N$36  (via drill 0.3)
  Top 0.305: R7.2 8,25.7 7.3,25.7 7,26 v7,27.4 | v5.4,33.9 5.4,33.6 5.3,33.5 5.3,32.3 5.4,32.2 5.4,31.1 Q1.B
  Bottom 0.305: v7,27.4 7.2,27.6 7.4,27.6 8.4,28.6 8.4,30.3 5.4,33.3 v5.4,33.9
N$38
  Top 0.305: R13.2 8,46.7 6.6,46.7 5.4,47.9 5.4,49.1 T4.B
N$39
  Top 0.305: T4.C 5.5,50.9 5.4,51 4,51 SG.C
N$40
  Top 0.305: R14.2 8,50.2 6.9,50.2 6.9,49.9 6.7,49.7 6.7,49.1 T4.E
SCK
  Top 0.305: 36.5,30.12 35.88,30.12 35.75,30.25 32.38,30.25 31.75,30.88 31.75,32.25 30.5,33.5 30.5,35.6 29.55,36.55 29.55,46.85 30.5,47.8 30.5,49.25
  Top 0.406: 36.5,30.12 IC1.16 | 30.5,49.25 29,50.75 U$1.D13
SG  (via drill 0.3)
  Top 0.305: v44.35,27.75 45.1,28.5 48.88,28.5 IC1.38 | 20.4,40.6 17.3,40.6 9.6,48.3 8,48.3 R13.1 | v24.15,34.5 24.15,37.06 JP3.4 | v31.7,16.25 31.7,16.57 arc45 31.61,16.79 28.2,20.2 28.2,23.27 arc45 28.11,23.49 v27.05,24.55
  Top 0.406: JP3.4 20.4,40.6
  Bottom 0.305: v44.35,27.75 arc-45 44.28,27.58 38.85,22.15 38.85,13.68 arc-45 38.76,13.46 37.95,12.65 35.78,12.65 arc-45 35.56,12.74 32.55,15.75 32.33,15.75 arc-45 32.11,15.84 v31.7,16.25 | v27.05,24.55 27.05,27.97 arc45 26.96,28.19 24.24,30.91 arc-45 24.15,31.13 v24.15,34.5
STEP  (via drill 0.3)
  Top 0.305: IC1.42 48.85,31.75 48,31.75 47.9,31.85 47.55,31.85 47.25,31.55 47.15,31.55 v46.5,30.9 | R9.1 8,34.3 9.1,34.3 9.5,34.7 9.5,37.6 9.7,37.8 11,37.8 R16.1 11.1,37.8 15.2,37.8 17.1,35.9 20.5,35.9 20.5,35.7 JP3.2 | v28.8,44.95 28.8,38.53 arc-45 28.71,38.31 v28.6,38.2
  Bottom 0.305: v46.5,30.9 46.4,30.8 41.63,30.8 arc-45 41.41,30.89 39.4,32.9 39.4,43.07 arc45 39.31,43.29 39.25,43.35 39.25,43.87 arc45 39.16,44.09 37.9,45.35 29.33,45.35 arc45 29.11,45.26 v28.8,44.95 | JP3.2 20.55,35.6 21.15,35.6 21.35,35.8 22,35.8 22.1,35.7 25.2,35.7 25.55,35.35 26.4,35.35 26.95,35.9 27,35.9 28.51,37.41 arc45 28.6,37.63 v28.6,38.2
VCC  (via drill 0.3)
  Top 0.406: IC1.4 44.38,35.5 44.38,34.38 v44.98,33.77 45.27,33.77 45.6,34.1 47.2,34.1 47.5,34.4 48.1,34.99 C3.2 | IC1.36 49,26.88 | 44.38,23.12 IC1.30 44.4,23.2 44.4,24.5 44.5,24.6 48.24,24.6 | IC1.36 50.34,26.94 | 50.95,27.7 51.52,27.7 C7.2 | C5.2 | IC1.36 48.8,26.9 v46.9,26.9 46.8,26.9 | v47.88,23.25 48.24,23.25 48.24,24.6 | C4.2 49.4,24.25 48.9,24.6 48.24,24.6
  Top 0.61: 50.34,26.94 50.95,27.7 | C7.2 C5.2
  Top 0.813: C6.2 48.23,22.9 v47.88,23.25
  Top 1.016: v39.7,14.4 41.2,14.4
  Bottom 0.305: v44.98,33.77 44.75,33.75
  Bottom 0.406: 48,23.38 v47.88,23.25 | 48,26.9 v46.9,26.9
  Bottom 1.016: v44.98,33.77 48,31 48,26.9 48,23.38 41.48,23.38 39.7,21.85 v39.7,14.4
  pour Top (isolate 0.406): -0.85,21 28.85,20.9 33.5,14.7 69.65,14.7 69.75,-0.88 -0.75,-0.88
VHS
  Top 0.406: 49,26.12 IC1.35 50.66,26.14 50.9,26.15 51.25,26.15 C7.1

### Text on the board
tNames: GND | !CS | SG | DIR | STEP | !EN | TOS-100 | Stepper Motor Shield | for Arduino | A1 | A2 | B1 | Motor | B2 | Power | <40V | GND | GND | v1.5 | This work is licensed under a / Creative Commons Attribution 3.0 Germany License.
bNames: For documentation & more information see | www.motioncontrol-community.org/hardware/tos-100